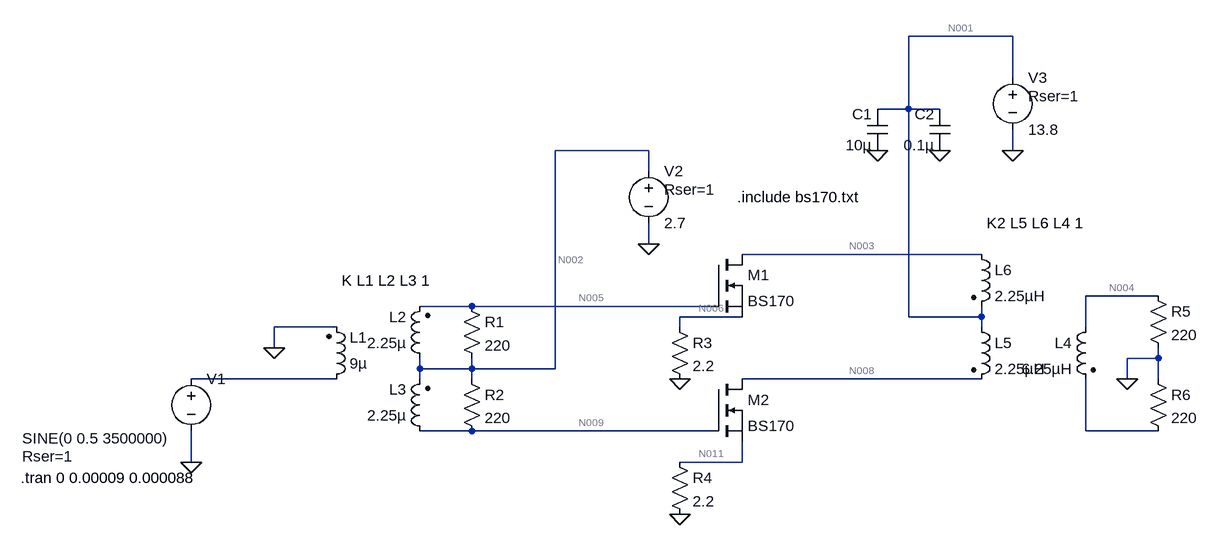
[diagram p0: schematic qlab 10w stage 1.asc]
qlab 10w stage 1.asc, the LTspice schematic file:
Version 4
SHEET 1 1396 680
WIRE 1104 -400 944 -400
WIRE 1104 -336 1104 -400
WIRE 944 -288 944 -400
WIRE 944 -288 896 -288
WIRE 992 -288 944 -288
WIRE 544 -224 400 -224
WIRE 1104 -224 1104 -256
WIRE 544 -192 544 -224
WIRE 544 -80 544 -112
WIRE 1056 -64 688 -64
WIRE 1328 0 1216 0
WIRE 272 16 192 16
WIRE 640 16 272 16
WIRE 688 32 592 32
WIRE 944 32 944 -288
WIRE 1056 32 1056 16
WIRE 1056 32 944 32
WIRE 64 48 -32 48
WIRE 592 48 592 32
WIRE 1056 48 1056 32
WIRE 1216 48 1216 0
WIRE -32 80 -32 48
WIRE 1328 96 1328 80
WIRE 1328 96 1280 96
WIRE 192 112 192 96
WIRE 272 112 272 96
WIRE 272 112 192 112
WIRE 400 112 400 -224
WIRE 400 112 272 112
WIRE 64 128 -160 128
WIRE 192 128 192 112
WIRE 272 128 272 112
WIRE 1056 128 688 128
WIRE 1280 128 1280 96
WIRE 1328 128 1328 96
WIRE 272 208 192 208
WIRE 640 208 272 208
WIRE 1216 208 1216 128
WIRE 1328 208 1216 208
WIRE -160 256 -160 208
WIRE 688 256 688 224
WIRE 688 256 592 256
FLAG -160 256 0
FLAG -32 80 0
FLAG 544 -80 0
FLAG 592 128 0
FLAG 592 336 0
FLAG 1104 -224 0
FLAG 1280 128 0
FLAG 896 -224 0
FLAG 992 -224 0
DATAFLAG 544 16 ""
DATAFLAG 448 208 ""
DATAFLAG 864 -64 ""
SYMBOL ind2 48 144 M180
WINDOW 0 36 80 Left 2
WINDOW 3 36 40 Left 2
SYMATTR InstName L1
SYMATTR Value 9µ
SYMATTR Type ind
SYMBOL ind2 208 224 R180
WINDOW 0 36 80 Left 2
WINDOW 3 36 40 Left 2
SYMATTR InstName L3
SYMATTR Value 2.25µ
SYMATTR Type ind
SYMBOL ind2 208 112 R180
WINDOW 0 36 80 Left 2
WINDOW 3 36 40 Left 2
SYMATTR InstName L2
SYMATTR Value 2.25µ
SYMATTR Type ind
SYMBOL voltage -160 112 R0
WINDOW 3 -260 107 Left 2
WINDOW 123 0 0 Left 0
WINDOW 39 -260 135 Left 2
SYMATTR InstName V1
SYMATTR Value SINE(0 0.5 3500000)
SYMATTR SpiceLine Rser=1
SYMBOL res 256 0 R0
SYMATTR InstName R1
SYMATTR Value 220
SYMBOL res 256 112 R0
SYMATTR InstName R2
SYMATTR Value 220
SYMBOL voltage 544 -208 R0
WINDOW 123 0 0 Left 0
WINDOW 39 24 44 Left 2
SYMATTR InstName V2
SYMATTR Value 2.7
SYMATTR SpiceLine Rser=1
SYMBOL nmos 640 -64 R0
SYMATTR InstName M1
SYMATTR Value BS170
SYMATTR Prefix X
SYMBOL nmos 640 128 R0
SYMATTR InstName M2
SYMATTR Value BS170
SYMATTR Prefix X
SYMBOL res 576 32 R0
SYMATTR InstName R3
SYMATTR Value 2.2
SYMBOL res 576 240 R0
SYMATTR InstName R4
SYMATTR Value 2.2
SYMBOL ind2 1232 32 M0
SYMATTR InstName L4
SYMATTR Value 6.25µH
SYMATTR Type ind
SYMBOL ind2 1040 32 R0
SYMATTR InstName L5
SYMATTR Value 2.25µH
SYMATTR Type ind
SYMBOL ind2 1040 -80 R0
SYMATTR InstName L6
SYMATTR Value 2.25µH
SYMATTR Type ind
SYMBOL voltage 1104 -352 R0
WINDOW 123 0 0 Left 0
WINDOW 39 24 44 Left 2
SYMATTR InstName V3
SYMATTR Value 13.8
SYMATTR SpiceLine Rser=1
SYMBOL res 1312 -16 R0
SYMATTR InstName R5
SYMATTR Value 220
SYMBOL res 1312 112 R0
SYMATTR InstName R6
SYMATTR Value 220
SYMBOL cap 912 -224 R180
WINDOW 0 24 56 Left 2
WINDOW 3 24 8 Left 2
SYMATTR InstName C1
SYMATTR Value 10µ
SYMBOL cap 1008 -224 R180
WINDOW 0 24 56 Left 2
WINDOW 3 24 8 Left 2
SYMATTR InstName C2
SYMATTR Value 0.1µ
TEXT -422 280 Left 2 !.tran 0 0.00009 0.000088
TEXT 72 -24 Left 2 !K L1 L2 L3 1
TEXT 1064 -112 Left 2 !K2 L5 L6 L4 1
TEXT 680 -152 Left 2 !.include bs170.txt

The netlist it stands for:
* qlab 10w stage 1.asc
L1 N007 0 9µ
L3 N009 N002 2.25µ
L2 N002 N005 2.25µ
V1 N007 0 SINE(0 0.5 3500000) Rser=1
R1 N005 N002 220
R2 N002 N009 220
V2 N002 0 2.7 Rser=1
XM1 N003 N005 N006 BS170  ; pins D G S
XM2 N008 N009 N011 BS170  ; pins D G S
R3 N006 0 2.2
R4 N011 0 2.2
L4 N004 N010 6.25µH
L5 N001 N008 2.25µH
L6 N003 N001 2.25µH
V3 N001 0 13.8 Rser=1
R5 N004 0 220
R6 0 N010 220
C1 0 N001 10µ
C2 0 N001 0.1µ
.tran 0 0.00009 0.000088
K L1 L2 L3 1
K2 L5 L6 L4 1
.include bs170.txt
.backanno
.end

* Results of the author's LTspice run, read from the files saved beside the schematic
* Operating Point, zero values left out:
*   V(n009) = 2.7 V
*   V(n002) = 2.7 V
*   V(n005) = 2.7 V
*   V(n006) = 47.18 mV
*   V(n003) = 13.76 V
*   V(n011) = 47.18 mV
*   V(n008) = 13.76 V
*   V(n001) = 13.76 V
*   I(L6) = -21.45 mA
*   I(L5) = 21.45 mA
*   I(R4) = 21.45 mA
*   I(R3) = 21.45 mA
*   I(V3) = -42.89 mA
*   Ix(m1:1) = 21.45 mA
*   Ix(m1:3) = -21.45 mA
*   Ix(m2:1) = 21.45 mA
*   Ix(m2:3) = -21.45 mA
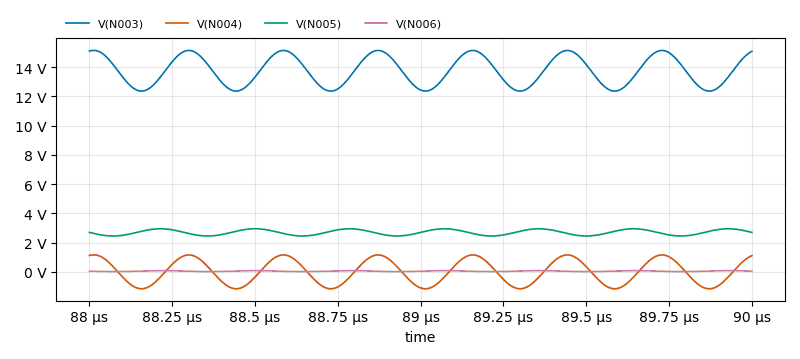
[diagram p1: Transient Analysis of qlab 10w stage 1.asc, plotted from the saved traces]
* Transient Analysis, 1 run:
*   V(N003): min 12.36 V, max 15.15 V, average 13.76 V, rms 13.79 V, last 15.09 V
*   V(N004): min -1.159 V, max 1.164 V, average 119.3 µV, rms 817.1 mV, last 1.11 V
*   V(N005): min 2.451 V, max 2.949 V, average 2.7 V, rms 2.706 V, last 2.699 V
*   V(N006): min 19.72 mV, max 83.74 mV, average 49.47 mV, rms 54.41 mV, last 47.16 mV